# Altium schematic sheet [05] - BMS.SchDoc: BMS
size 433 x 279 mm; Author: ZAG; DrawnBy: ZAG; DocumentNumber: 5; SheetNumber: 5; SheetTotal: 8; PageSetup: Record=PageOptions|CenterHorizontal=True|CenterVertical=True|PrintScale=0.96|XCorrection=1.00|YCorrection=1.00|PrintKind=2|BorderSize=5000000|LeftOffset=0|BottomOffset=0|Orientation=2|PaperLength=4318|PaperWidth=2794|Scale=100|PaperSource=15|PrintQuality=600|MediaType=1|DitherType=10|PaperKind=11x17|PrintScaleMode=1; PCBRevision: 01; SchRevision: 01; Project: VAN BATT CTRLR V1; SchStatus: PRELIM
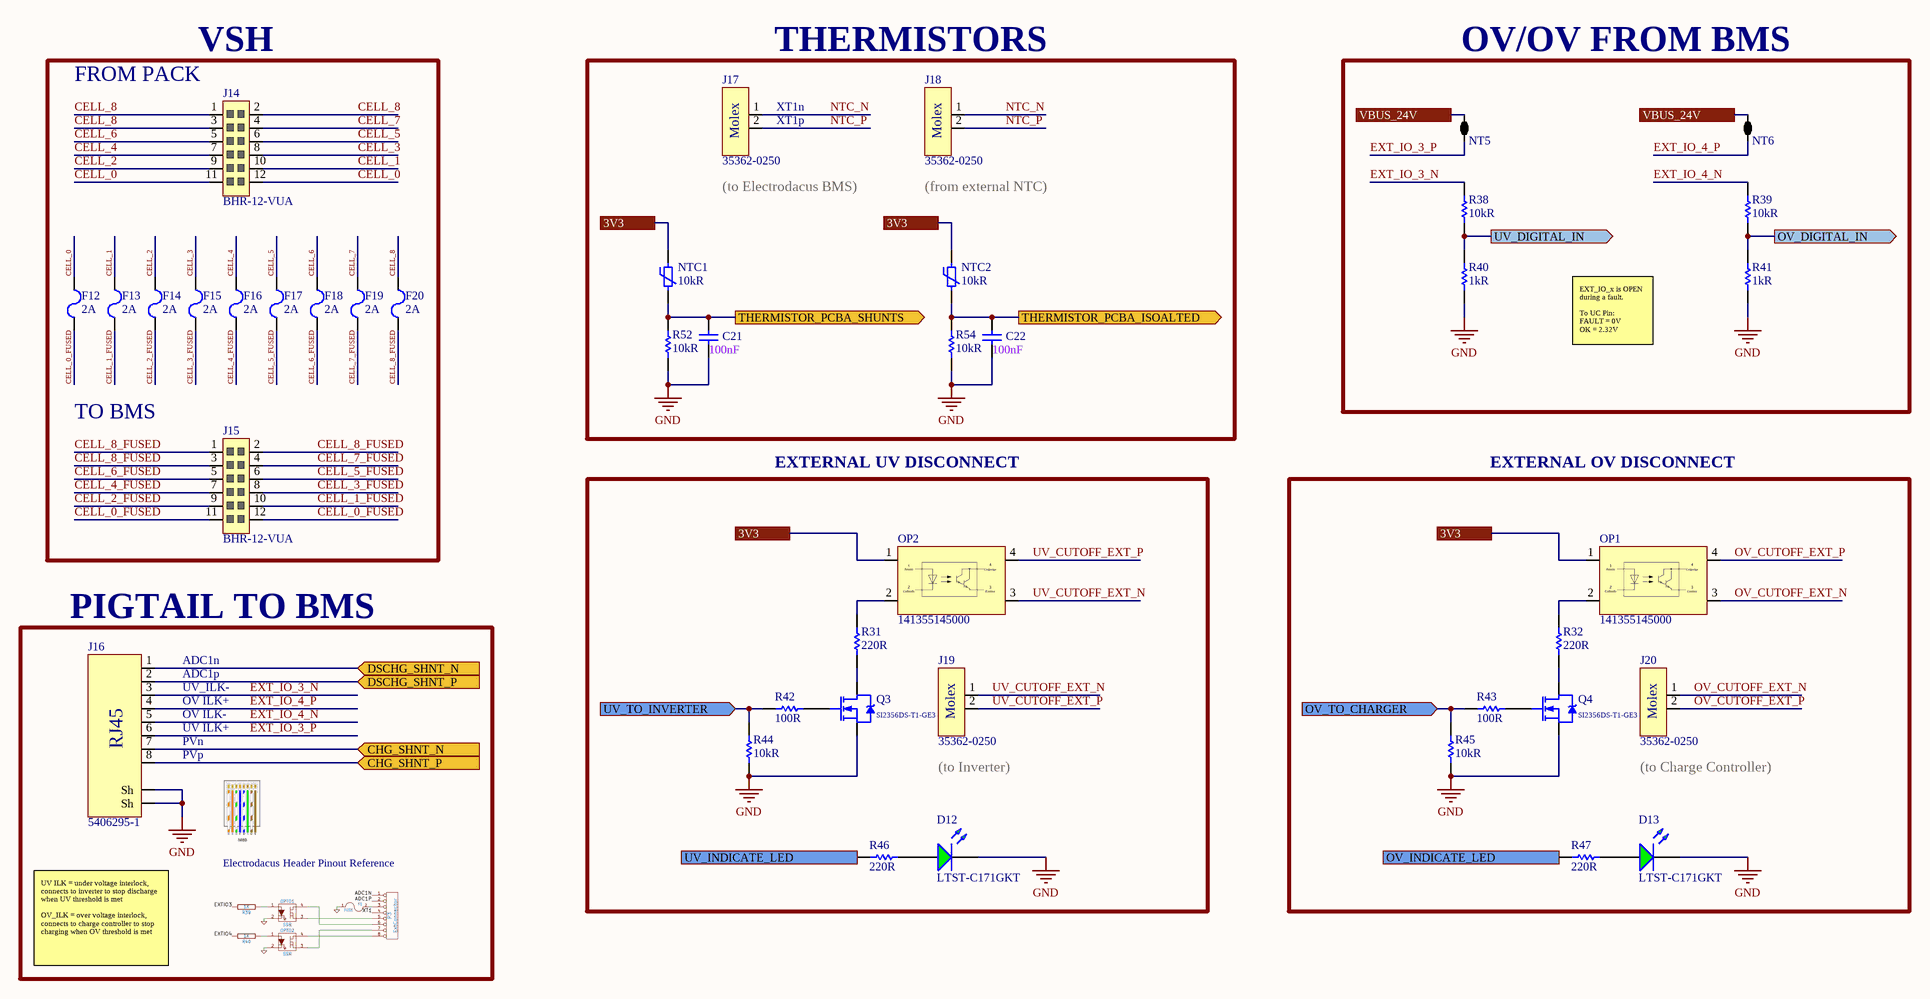
[diagram p0: [05] - BMS.SchDoc]

## Parts
C21  100nF  [INCH 0603 - METRIC 1608 - H090]
C22  100nF  [INCH 0603 - METRIC 1608 - H090]
D12  LTST-C171GKT  [LED - 0805 - GREEN]
D13  LTST-C171GKT  [LED - 0805 - GREEN]
F12  Current Rating: 2A  [FUSC0805x45]  (hidden comment: MFU0805FF02000P500)
F13  Current Rating: 2A  [FUSC0805x45]  (hidden comment: MFU0805FF02000P500)
F14  Current Rating: 2A  [FUSC0805x45]  (hidden comment: MFU0805FF02000P500)
F15  Current Rating: 2A  [FUSC0805x45]  (hidden comment: MFU0805FF02000P500)
F16  Current Rating: 2A  [FUSC0805x45]  (hidden comment: MFU0805FF02000P500)
F17  Current Rating: 2A  [FUSC0805x45]  (hidden comment: MFU0805FF02000P500)
F18  Current Rating: 2A  [FUSC0805x45]  (hidden comment: MFU0805FF02000P500)
F19  Current Rating: 2A  [FUSC0805x45]  (hidden comment: MFU0805FF02000P500)
F20  Current Rating: 2A  [FUSC0805x45]  (hidden comment: MFU0805FF02000P500)
J14  BHR-12-VUA  [SHDRV12W64P254_6X2_2284X880H880]
J15  BHR-12-VUA  [SHDRV12W64P254_6X2_2284X880H880]
J16  5406295-1  [TE_5406295-1]
J17  35362-0250  [MOLEX_35362]
J18  35362-0250  [MOLEX_35362]
J19  35362-0250  [MOLEX_35362]
J20  35362-0250  [MOLEX_35362]
NT5  2 way net tie junction  [2way_LP]  (value not drawn)  (net tie, no BOM)
NT6  2 way net tie junction  [2way_LP]  (value not drawn)  (net tie, no BOM)
NTC1  10kR  [INCH 0603 - METRIC 1608 - H055N]
NTC2  10kR  [INCH 0603 - METRIC 1608 - H055N]
OP1  141355145000  [SOT23-4P127_700X210L50X40N]
OP2  141355145000  [SOT23-4P127_700X210L50X40N]
Q3  SI2356DS-T1-GE3  [SOT23-3P95_237X112L50X42N]
Q4  SI2356DS-T1-GE3  [SOT23-3P95_237X112L50X42N]
R31  220R  [INCH 0603 - METRIC 1608 - H055]
R32  220R  [INCH 0603 - METRIC 1608 - H055]
R38  10kR  [INCH 0603 - METRIC 1508 - H050]
R39  10kR  [INCH 0603 - METRIC 1508 - H050]
R40  1kR  [INCH 0603 - METRIC 1508 - H050]
R41  1kR  [INCH 0603 - METRIC 1508 - H050]
R42  100R  [INCH 0603 - METRIC 1608 - H055]
R43  100R  [INCH 0603 - METRIC 1608 - H055]
R44  10kR  [INCH 0603 - METRIC 1508 - H050]
R45  10kR  [INCH 0603 - METRIC 1508 - H050]
R46  220R  [INCH 0603 - METRIC 1608 - H055]
R47  220R  [INCH 0603 - METRIC 1608 - H055]
R52  10kR  [INCH 0603 - METRIC 1508 - H050]
R54  10kR  [INCH 0603 - METRIC 1508 - H050]

## Blocks framed on the sheet
VSH: F12-F20 J14 J15
THERMISTORS: C21 C22 J17 J18 NTC1 NTC2 R52 R54
OV/OV FROM BMS: NT5 NT6 R38-R41
EXTERNAL UV DISCONNECT: D12 J19 OP2 Q3 R31 R42 R44 R46
EXTERNAL OV DISCONNECT: D13 J20 OP1 Q4 R32 R43 R45 R47
PIGTAIL TO BMS: J16

## Ports
3V3, CHG_SHNT_N (in), CHG_SHNT_P (in), DSCHG_SHNT_N (in), DSCHG_SHNT_P (in), OV_DIGITAL_IN (out), OV_INDICATE_LED (in), OV_TO_CHARGER (in), THERMISTOR_PCBA_ISOALTED (out), THERMISTOR_PCBA_SHUNTS (out), UV_DIGITAL_IN (out), UV_INDICATE_LED (in), UV_TO_INVERTER (in), VBUS_24V

## Nets
GND: C21.1 C22.1 D12.C D13.C J16.0(Sh) Q3.2(S) Q4.2(S) R40.1 R41.1 R44.1 R45.1 R52.1 R54.1
3V3: NTC1.2 NTC2.2 OP1.1(A) OP2.1(A) ; port 3V3
CELL_0: F12.1 J14.11 J14.12
CELL_0_FUSED: F12.2 J15.11 J15.12
CELL_1: F13.1 J14.10
CELL_1_FUSED: F13.2 J15.10
CELL_2: F14.1 J14.9
CELL_2_FUSED: F14.2 J15.9
CELL_3: F15.1 J14.8
CELL_3_FUSED: F15.2 J15.8
CELL_4: F16.1 J14.7
CELL_4_FUSED: F16.2 J15.7
CELL_5: F17.1 J14.6
CELL_5_FUSED: F17.2 J15.6
CELL_6: F18.1 J14.5
CELL_6_FUSED: F18.2 J15.5
CELL_7: F19.1 J14.4
CELL_7_FUSED: F19.2 J15.4
CELL_8: F20.1 J14.1 J14.2 J14.3
CELL_8_FUSED: F20.2 J15.1 J15.2 J15.3
CHG_SHNT_N: J16.7 ; port CHG_SHNT_N
CHG_SHNT_P: J16.8 ; port CHG_SHNT_P
DSCHG_SHNT_N: J16.1 ; port DSCHG_SHNT_N
DSCHG_SHNT_P: J16.2 ; port DSCHG_SHNT_P
EXT_IO_3_N: J16.3 R38.2
EXT_IO_3_P: J16.6 NT5.1
EXT_IO_4_N: J16.5 R39.2
EXT_IO_4_P: J16.4 NT6.1
NTC_N: J17.1 J18.1
NTC_P: J17.2 J18.2
OV_CUTOFF_EXT_N: J20.1 OP1.3(E)
OV_CUTOFF_EXT_P: J20.2 OP1.4(C)
OV_DIGITAL_IN: R39.1 R41.2 ; port OV_DIGITAL_IN
OV_INDICATE_LED: R47.1 ; port OV_INDICATE_LED
OV_TO_CHARGER: R43.1 R45.2 ; port OV_TO_CHARGER
THERMISTOR_PCBA_ISOALTED: C22.2 NTC2.1 R54.2 ; port THERMISTOR_PCBA_ISOALTED
THERMISTOR_PCBA_SHUNTS: C21.2 NTC1.1 R52.2 ; port THERMISTOR_PCBA_SHUNTS
UV_CUTOFF_EXT_N: J19.1 OP2.3(E)
UV_CUTOFF_EXT_P: J19.2 OP2.4(C)
UV_DIGITAL_IN: R38.1 R40.2 ; port UV_DIGITAL_IN
UV_INDICATE_LED: R46.1 ; port UV_INDICATE_LED
UV_TO_INVERTER: R42.1 R44.2 ; port UV_TO_INVERTER
VBUS_24V: NT5.2 NT6.2 ; port VBUS_24V
NetD12_A: D12.A R46.2
NetD13_A: D13.A R47.2
NetOP1_2: OP1.2(C) R32.2
NetOP2_2: OP2.2(C) R31.2
NetQ3_1: Q3.1(G) R42.2
NetQ3_3: Q3.3(D) R31.1
NetQ4_1: Q4.1(G) R43.2
NetQ4_3: Q4.3(D) R32.1

## Notes on the sheet
- FROM PACK
- (near J17) XT1n
- (near J17) XT1p
- (near J17) (to Electrodacus BMS)
- (from external NTC)
- EXT_IO_x is OPEN during a fault.
  To UC Pin:
  FAULT = 0V
  OK = 2.32V
- TO BMS
- (near J16) ADC1n
- (near J16) ADC1p
- (near J16) UV_ILK-
- (near J16) OV ILK-
- (near J16) UV ILK+
- (near J16) OV ILK+
- (near J16) PVn
- (near J16) PVp
- (to Inverter)
- (to Charge Controller)
- Electrodacus Header Pinout Reference
- UV ILK = under voltage interlock, connects to inverter to stop discharge when UV threshold is met
  OV_ILK = over voltage interlock, connects to charge controller to stop charging when OV threshold is met
- SHEET TITLE
- SCH REV:
- PROJECT NAME
- PCB REV:
- DATE:
- DRAWN BY
- CONTACT
- MANUFACTURER, OR SALE OF PROCESSES OR PRODUCTS WITHOUT THE EXPRESSED WRITTEN CONSENT OF
- THE INFORMATION CONTAINED HEREIN IS DEEMED TO BE CONFIDENTIAL, PROPRIETARY, AND A TRADE SECRET OF
- THIS INFORMATION MAY NOT BE USED, REPRODUCED, OR DISCLOSED AS THE DIRECT OR INDIRECT BASIS FOR THE DEVELOPMENT,
- SHEET
- www.mule-labs.com <http://www.mule-labs.com>
- OF
- SIZE: B
- DO NOT SCALE DRAWING
- (in symbol 5406295-1) RJ45

## Library data of the parts
C21 C22 = CGA3E2X7R1E104K080AA: CAP CER 0.1UF 25V X7R 0603; Manufacturer: TDK; Tolerance: 10%; Supplier 1: Digi-Key; Manufacturer Part Number: CGA3E2X7R1E104K080AA; Stock 1: 40000; Pricing 1: 1=0.1, 10=0.068, 100=0.0304, 500=0.02172, 1000=0.01706 (USD); Mount: Surface Mount; Case/Package: 0603; Weight: 7.1E-05oz; Case Code (Metric): 1608; Case Code (Imperial): 0603; Min Operating Temperature: -55°C; Max Operating Temperature: 125°C; Packaging: Tape and Reel; Capacitance: 100nF; Voltage Rating: 25V; Dielectric: X7R; Termination: SMD/SMT; Package Quantity: 1; Voltage Rating (DC): 25V; Composition: Ceramic; Length: 1.6mm; Height: 0.8mm; Depth: 0.8mm; Width: 0.031inch; Thickness: 0.035inch; Lead Free: Lead Free; REACH SVHC: No SVHC; ComponentLink1URL: https://datasheet.ciiva.com/22725/1735392-22725638.pdf; ComponentLink1Description: https://datasheet.ciiva.com/22725/1735392-22725638.pdf; ComponentLink2URL: https://datasheet.ciiva.com/24220/cga3e2x7r1e104k080aa-265934-24220022.pdf; ComponentLink2Description: https://datasheet.ciiva.com/24220/cga3e2x7r1e104k080aa-265934-24220022.pdf; ComponentLink3URL: https://datasheet.ciiva.com/22725/1735392-22725639.pdf; ComponentLink3Description: https://datasheet.ciiva.com/22725/1735392-22725639.pdf; ComponentLink4URL: https://datasheet.ciiva.com/16427/mlccspec-automotive-general-midvoltage-en-16427320.pdf; ComponentLink4Description: https://datasheet.ciiva.com/16427/mlccspec-automotive-general-midvoltage-en-16427320.pdf; ComponentLink5URL: https://datasheet.ciiva.com/23803/1735392-23803082.pdf; ComponentLink5Description: https://datasheet.ciiva.com/23803/1735392-23803082.pdf; Supplier Part Number 1: 445-5667-1-ND; Category: Capacitor
D12 D13 = LTST-C171GKT: Lite-On LTST-C171GKT, CHIPLED 0805 Series Green LED, 569 nm 2012 (0805), Rectangle Lens SMD package; Manufacturer: Vishay Lite-On; Lens Colour: Clear,Colorless; Viewing Angle: 130°; Lens Style: Clear,Diffused,Colorless,Rectangular; Luminous Intensity: 12mcd; Forward Current: 30mA; Forward Voltage: 2.1V; Power Rating: 100mW; Dominant Wavelength: 569nm; Test Current: 10mA; Lens Transparency: Clear; Number of Elements: 1; Wavelength: 585nm; Reverse Voltage: 5V; Supplier 1: Digi-Key; Manufacturer Part Number: LTST-C171GKT; Stock 1: 271428; Pricing 1: 1=0.29, 10=0.211, 25=0.1556, 100=0.1111, 250=0.07556, 500=0.06666, 1000=0.05222 (USD); Mount: Surface Mount; Case/Package: 0805; Number of Pins: 2; Color: Green; Case Code (Metric): 2012; Case Code (Imperial): 0805; Min Operating Temperature: -55°C; Max Operating Temperature: 85°C; Package Quantity: 1; Packaging: Tape and Reel; Illumination Colour: Green; Power Dissipation: 100mW; Number of LEDs: 1; Length: 2mm; Height: 0.8mm; Width: 1.25mm; Depth: 1.25mm; Radiation Hardening: No; Lead Free: Lead Free; ComponentLink1URL: https://datasheet.ciiva.com/2110/ltst-c171gkt-2110000.pdf; ComponentLink1Description: https://datasheet.ciiva.com/2110/ltst-c171gkt-2110000.pdf; ComponentLink2URL: https://datasheet.ciiva.com/2110/ltst-c171gkt-2110001.pdf; ComponentLink2Description: https://datasheet.ciiva.com/2110/ltst-c171gkt-2110001.pdf; ComponentLink3URL: https://datasheet.ciiva.com/2110/ltst-c171gkt-2110002.pdf; ComponentLink3Description: https://datasheet.ciiva.com/2110/ltst-c171gkt-2110002.pdf; ComponentLink4URL: https://datasheet.ciiva.com/16396/ltst-c171gkt-16396549.pdf; ComponentLink4Description: https://datasheet.ciiva.com/16396/ltst-c171gkt-16396549.pdf; ComponentLink5URL: https://datasheet.ciiva.com/11773/0900766b80dc0296-11773991.pdf; ComponentLink5Description: https://datasheet.ciiva.com/11773/0900766b80dc0296-11773991.pdf; ComponentLink6URL: https://datasheet.ciiva.com/12400/lite-on-ltst-c171gkt-190133-12400647.pdf; ComponentLink6Description: https://datasheet.ciiva.com/12400/lite-on-ltst-c171gkt-190133-12400647.pdf; Supplier Part Number 1: 160-1423-1-ND; Category: LED
F12-F20 = MFU0805FF02000P500: FUSE 2A 32V SMT 0805 THIN; Manufacturer 1: Vishay Beyschlag; Approvals: UL; Description 1: Fuse; 24 Milliohms to 660 Milliohms (Cold) @ 0.1; 32 V; 0805; 15 ° C; 35; Category 1: Fuses; Body Material: Ceramic; Fuse Type: Board Mount (Cartridge Style Excluded); DC Cold Resistance: 67mR; Manufacturer Part Number: MFU0805FF02000P500; Supplier 1: Digi-Key; Supplier Part Number 1: 749-1743-1-ND; Case/Package: 0805; Case Code (Imperial): 0805; Category: Fuse; Manufacturer Part Number 1: MFU0805FF02000P500; RoHS 1: Yes; Stock 1: 5535; Pricing 1: 1=0.48000, 5=0.46800, 10=0.45300, 50=0.38100, 100=0.31630, 250=0.28756, 500=0.24440, 1000=0.21566 (USD); Mount: Surface Mount,PCB; Number of Pins: 2; Min Operating Temperature: -55°C; Max Operating Temperature: 125°C; Termination: SMD/SMT; Package Quantity: 5000; Voltage Rating (DC): 32V; Packaging: Tape and Reel; Resistance: 67mR; Length: 0.079inch; Height: 0.018inch; Width: 0.049inch; Lead Free: Lead Free; ComponentLink4URL: https://datasheet.ciiva.com/18427/70121790-18427623.pdf?src-supplier=Allied+Electronics; ComponentLink4Description: https://datasheet.ciiva.com/18427/70121790-18427623.pdf?src-supplier=Allied+Electronics; ComponentLink5URL: https://datasheet.ciiva.com/11337/mfuserie-11337802.pdf?src-supplier=Avnet; ComponentLink5Description: https://datasheet.ciiva.com/11337/mfuserie-11337802.pdf?src-supplier=Avnet; ComponentLink6URL: https://datasheet.ciiva.com/4485/mfuserie-239895-4485662.pdf?src-supplier=Mouser; ComponentLink6Description: https://datasheet.ciiva.com/4485/mfuserie-239895-4485662.pdf?src-supplier=Mouser; RoHS: Yes
J14 J15 = BHR-12-VUA: CONN HEADER VERT 12POS 2.54MM; Manufacturer: Adam Tech; Number of Positions: 12; Gender: Male; Connector Type: Male Pin; Pitch: 0.1inch; Supplier 1: Digi-Key; Manufacturer Part Number: BHR-12-VUA; RoHS: Yes; Mount: Through Hole; Contact Plating: Gold; Contact Material: Copper; Color: Black; Number of Rows: 2; Packaging: Bulk; Termination: Solder; Number of Contacts: 12; Row Spacing: 0.1inch; REACH SVHC: Unknown; Supplier Part Number 1: 2057-BHR-12-VUA-ND
J16 = 5406295-1: Conn RJ-45 F 8 POS RA Thru-Hole; Manufacturer: TE Connectivity; Shielding: Shielded; Number of Ports: 1; Direction: Down; Number of Contacts: 8; Max Voltage Rating (AC): 150V; Connector Type: Jack; Keyed: No; Element Configuration: Single; PCB Mounting Orientation: Right Angle; Pitch: 2.54mm; Tail Length: 3.56mm; PCB Thickness: 1.57mm; Supplier 1: Digi-Key; Manufacturer Part Number: 5406295-1; RoHS: Yes; Category: Modular / Ethernet Connectors; Stock 1: 1850; Pricing 1: 1=3.11000, 10=2.98100, 25=2.73280, 50=2.60840, 100=2.48420, 250=2.17372, 500=2.11160, 1000=1.80107, 2500=1.67686 (USD); Contact Plating: Gold; Contact Material: Bronze; Housing Color: Black; Housing Material: Nylon; Min Operating Temperature: -40°C; Max Operating Temperature: 85°C; Termination: Solder; Orientation: Right Angle; Packaging: Tray; Package Quantity: 80; Number of Rows: 1; Number of Positions Loaded: 8; Number of Positions: 8; Length: 17.78mm; Depth: 21.34mm; Radiation Hardening: No; Flammability Rating: UL94 V-0; ELV: Compliant; RoHS Compliant: Yes; ComponentLink1URL: https://datasheet.ciiva.com/18490/eng-cd-5406295-b1-18490859.pdf?src-supplier=Digi-Key; ComponentLink1Description: https://datasheet.ciiva.com/18490/eng-cd-5406295-b1-18490859.pdf?src-supplier=Digi-Key; Supplier Part Number 1: A115395-ND
J17-J20 = 35362-0250: Conn Shrouded Header HDR 2 POS 2mm Solder ST Thru-Hole Bag; Manufacturer: Molex; Current Rating: 2A; Number of Positions: 2; Gender: Male; Contact Resistance: 20mR; Voltage Rating: 125V; Max Voltage Rating (AC): 600V; Max Voltage Rating (DC): 125.125kV; Insulation Resistance: 1GR; Glow Wire Compliant: Non-compliant; Supplier 1: Digi-Key; Manufacturer Part Number: 35362-0250; Stock 1: 15060; Pricing 1: 1=0.27000, 10=0.25400, 100=0.17630, 500=0.14916, 1000=0.12204, 5000=0.10848, 10000=0.09831 (USD); RoHS: Yes; Mount: Through Hole,Cable; Color: Natural; Housing Color: Natural; Housing Material: Nylon; Contact Material: Brass; Contact Plating: Tin,Gold; Min Operating Temperature: -40°C; Max Operating Temperature: 105°C; Packaging: Bulk; Termination: Solder; Number of Rows: 1; Package Quantity: 1000; Orientation: Vertical; Number of Contacts: 2; Voltage Rating (AC): 125V; Voltage Rating (DC): 125V; Max Current Rating: 2A; Number of Circuits: 2; Length: 16.8mm; Height: 2.3mm; Pitch: 2mm; Width: 8.3mm; Depth: 2.3mm; Lead Pitch: 2mm; Radiation Hardening: No; REACH SVHC: Unknown; Halogen Free: Low Halogen; Lead Free: Lead Free; Flammability Rating: UL94 V-0; ComponentLink1URL: https://datasheet.ciiva.com/7436/1710398-7436100.pdf?src-supplier=Newark; ComponentLink1Description: https://datasheet.ciiva.com/7436/1710398-7436100.pdf?src-supplier=Newark; ComponentLink2URL: https://datasheet.ciiva.com/16658/0353620250-pcb-headers-16658021.pdf?src-supplier=Avnet+Europe; ComponentLink2Description: https://datasheet.ciiva.com/16658/0353620250-pcb-headers-16658021.pdf?src-supplier=Avnet+Europe; ComponentLink3URL: https://datasheet.ciiva.com/5155/0353620250-pcb-headers-163392-5155548.pdf?src-supplier=Mouser; ComponentLink3Description: https://datasheet.ciiva.com/5155/0353620250-pcb-headers-163392-5155548.pdf?src-supplier=Mouser; ComponentLink4URL: https://datasheet.ciiva.com/19461/1299024-19461900.pdf?src-supplier=Jameco; ComponentLink4Description: https://datasheet.ciiva.com/19461/1299024-19461900.pdf?src-supplier=Jameco; ComponentLink5URL: https://datasheet.ciiva.com/30136/325870353620250-pcb-headers-30136716.pdf?src-supplier=Onlinecomponents.com; ComponentLink5Description: https://datasheet.ciiva.com/30136/325870353620250-pcb-headers-30136716.pdf?src-supplier=Onlinecomponents.com; ComponentLink6URL: https://datasheet.ciiva.com/7920/1905931-7920887.pdf?src-supplier=Element14; ComponentLink6Description: https://datasheet.ciiva.com/7920/1905931-7920887.pdf?src-supplier=Element14; Supplier Part Number 1: WM18920-ND
NT5 NT6 = 2way: ComponentLink1URL: http://www.edatools.cz/addons; ComponentLink1Description: Source; FootprintNote: LP=12mil, MP=40mil, HP=120mil
NTC1 NTC2 = NCP18XV103E03RB: Thermistor NTC 10K Ohm 3% 2-Pin 0603 Surface Mount Solder Pad 3934K T/R; Manufacturer: Murata; Max Power Dissipation: 100mW; Supplier 1: Digi-Key; Manufacturer Part Number: NCP18XV103E03RB; RoHS: Yes; Category: Thermistors; Stock 1: 39439; Pricing 1: 1=0.25000, 5=0.22800, 10=0.20300, 25=0.18160, 50=0.15960, 100=0.13610, 500=0.11258, 1000=0.09425 (USD); Mount: Surface Mount; Case/Package: 0603; Number of Pins: 2; Case Code (Metric): 1608; Case Code (Imperial): 0603; Min Operating Temperature: -40°C; Max Operating Temperature: 125°C; Package Quantity: 1; Packaging: Tape and Reel; Tolerance: 3%; Resistance: 10kR; Termination: SMD/SMT; Power Rating: 100mW; Length: 1.6mm; Width: 0.8mm; Height: 0.8mm; Depth: 0.8mm; Radiation Hardening: No; RoHS Compliant: Yes; ComponentLink1URL: http://www.mouser.com/ds/2/281/r44e-3685.pdf?src-supplier=Mouser; ComponentLink1Description: http://www.mouser.com/ds/2/281/r44e-3685.pdf?src-supplier=Mouser; ComponentLink2URL: http://www.murata.com/~/media/webrenewal/support/library/catalog/products/thermistor/ntc/r44e.ashx?src-supplier=Avnet; ComponentLink2Description: http://www.murata.com/~/media/webrenewal/support/library/catalog/products/thermistor/ntc/r44e.ashx?src-supplier=Avnet; ComponentLink3URL: http://www.murata.com/~/media/webrenewal/support/library/catalog/products/thermistor/ntc/r44e.ashx?src-supplier=Digi-Key; ComponentLink3Description: http://www.murata.com/~/media/webrenewal/support/library/catalog/products/thermistor/ntc/r44e.ashx?src-supplier=Digi-Key; ComponentLink4URL: http://www.murata.com/products/catalog/pdf/r44e.pdf?src-supplier=Digi-Key; ComponentLink4Description: http://www.murata.com/products/catalog/pdf/r44e.pdf?src-supplier=Digi-Key; Supplier Part Number 1: 490-12102-1-ND
OP1 OP2 = 141355145000: Optocoupler, Transistor, 3.75Kv, Sop Rohs Compliant: Yes; Manufacturer: Wurth Electronics; Supplier 1: Digi-Key; Manufacturer Part Number: 141355145000; RoHS: No; Stock 1: 2951; Pricing 1: 1=0.71000, 100=0.61200, 250=0.55500, 500=0.49800, 1000=0.41200 (USD); Supplier Part Number 1: 732-141355145000CT-ND
Q3 Q4 = SI2356DS-T1-GE3: Si2356DS Series 40 V 3.2 A 51 mOhm Surface Mount N-Channel Mosfet - SOT-23-3; Manufacturer: Vishay Siliconix; Rds On Max: 51mR; Input Capacitance: 370pF; Rise Time: 52ns; Drain to Source Voltage (Vdss): 40V; Continuous Drain Current (ID): 4.3A; Max Power Dissipation: 1.7W; Gate to Source Voltage (Vgs): 12V; Drain to Source Resistance: 56mR; Fall Time: 53ns; Turn-Off Delay Time: 18ns; Threshold Voltage: 1.5V; Element Configuration: Single; Number of Channels: 1; Turn-On Delay Time: 10ns; Supplier 1: Digi-Key; Manufacturer Part Number: SI2356DS-T1-GE3; RoHS: Yes; Category: MOSFETs; Stock 1: 50; Pricing 1: 1=0.42000, 10=0.34200, 100=0.23300, 500=0.17476, 1000=0.13108 (USD); Mount: Surface Mount; Case/Package: TO-236-3; Number of Pins: 3; Weight: 0.050717oz; Min Operating Temperature: -55°C; Max Operating Temperature: 150°C; Packaging: Tape and Reel; Package Quantity: 3000; Drain to Source Breakdown Voltage: 40V; REACH SVHC: No SVHC; Lead Free: Lead Free; RoHS Compliant: Yes; ComponentLink1URL: https://datasheet.ciiva.com/29755/si2356ds-29755664.pdf?src-supplier=Digi-Key; ComponentLink1Description: https://datasheet.ciiva.com/29755/si2356ds-29755664.pdf?src-supplier=Digi-Key; ComponentLink2URL: https://datasheet.ciiva.com/24111/si2356ds-268760-24111179.pdf?src-supplier=Mouser; ComponentLink2Description: https://datasheet.ciiva.com/24111/si2356ds-268760-24111179.pdf?src-supplier=Mouser; ComponentLink3URL: https://datasheet.ciiva.com/29755/si2356ds-29755653.pdf?src-supplier=Digi-Key; ComponentLink3Description: https://datasheet.ciiva.com/29755/si2356ds-29755653.pdf?src-supplier=Digi-Key; ComponentLink4URL: https://datasheet.ciiva.com/29755/si2356ds-29755658.pdf?src-supplier=Digi-Key; ComponentLink4Description: https://datasheet.ciiva.com/29755/si2356ds-29755658.pdf?src-supplier=Digi-Key; Supplier Part Number 1: SI2356DS-T1-GE3CT-ND
R31 R32 R46 R47 = RC0603FR-07220RL: RES SMD 220 OHM 1% 1/10W 0603; Manufacturer: Yageo; Temperature Coefficient: 100ppm/°C; Voltage Rating (DC): 50V; Power Rating: 100mW; Supplier 1: Digi-Key; Manufacturer Part Number: RC0603FR-07220RL; Stock 1: 8341820; Case/Package: 0603; Number of Pins: 2; Case Code (Imperial): 0603; Case Code (Metric): 1608; Min Operating Temperature: -55°C; Max Operating Temperature: 155°C; Resistance: 220R; Tolerance: 1%; Packaging: Tape and Reel; Composition: Thick Film; Voltage Rating: 50V; Package Quantity: 1; Termination: SMD/SMT; Number of Terminations: 2; Military Standard: Not; Max Power Dissipation: 100mW; Features: Moisture Resistant; Length: 1.6mm; Height: 0.022inch; Width: 0.031inch; Depth: 0.8mm; REACH SVHC: No SVHC; Lead Free: Lead Free; ComponentLink1URL: http://www.yageo.com/documents/recent/PYu-RC_Group_51_RoHS_L_9.pdf; ComponentLink1Description: http://www.yageo.com/documents/recent/PYu-RC_Group_51_RoHS_L_9.pdf; ComponentLink2URL: http://documents.rs-components.com/techlib://itc_doclist_GB.htm?stockno=5050303; ComponentLink2Description: http://documents.rs-components.com/techlib://itc_doclist_GB.htm?stockno=5050303; ComponentLink3URL: http://www.farnell.com/datasheets/1738695.pdf; ComponentLink3Description: http://www.farnell.com/datasheets/1738695.pdf; Supplier Part Number 1: 311-220HRCT-ND
R38 R39 R44 R45 R52 R54 = RR0816P-103-D: RES SMD 10K OHM 0.5% 1/16W 0603; Manufacturer: Susumu; Power Rating: 63mW; Voltage Rating: 75V; Temperature Coefficient: 25ppm/°C; Supplier 1: Digi-Key; Manufacturer Part Number: RR0816P-103-D; Stock 1: 1106095; Pricing 1: 1=0.11, 10=0.098, 100=0.0376, 1000=0.01654, 2500=0.01428 (USD); Case/Package: 0603; Number of Pins: 2; Weight: 7.1E-05oz; Case Code (Imperial): 0603; Case Code (Metric): 1608; Min Operating Temperature: -55°C; Max Operating Temperature: 125°C; Packaging: Tape and Reel; Resistance: 10kR; Tolerance: 0.5%; Package Quantity: 1; Termination: SMD/SMT; Composition: Thin Film; Number of Terminations: 2; Max Power Dissipation: 63mW; Voltage Rating (DC): 75V; Length: 1.6mm; Height: 0.4mm; Width: 0.8mm; Depth: 0.8mm; REACH SVHC: Unknown; Lead Free: Lead Free; ComponentLink1URL: https://datasheet.ciiva.com/11820/0900766b80808d64-11820656.pdf; ComponentLink1Description: https://datasheet.ciiva.com/11820/0900766b80808d64-11820656.pdf; ComponentLink2URL: https://datasheet.ciiva.com/2487/rr-data-sheet-2487034.pdf; ComponentLink2Description: https://datasheet.ciiva.com/2487/rr-data-sheet-2487034.pdf; ComponentLink3URL: https://datasheet.ciiva.com/2487/rr-data-sheet-2487035.pdf; ComponentLink3Description: https://datasheet.ciiva.com/2487/rr-data-sheet-2487035.pdf; ComponentLink4URL: https://datasheet.ciiva.com/2487/rr-data-sheet-2487036.pdf; ComponentLink4Description: https://datasheet.ciiva.com/2487/rr-data-sheet-2487036.pdf; Supplier Part Number 1: RR08P10.0KDCT-ND; Category: Resistor
R40 R41 = CRCW06031K00FKEA: RES SMD 1K OHM 1% 1/10W 0603; Manufacturer: Vishay Dale; Temperature Coefficient: 100ppm/°C; Power Rating: 100mW; Voltage Rating: 75V; Supplier 1: Digi-Key; Manufacturer Part Number: CRCW06031K00FKEA; RoHS: Yes; Category: Chip SMD Resistors; Stock 1: 445458; Pricing 1: 1=0.10000, 10=0.03400, 100=0.01390, 1000=0.00624, 2500=0.00542 (USD); Mount: Surface Mount; Case/Package: 0603; Number of Pins: 2; Contact Plating: Tin; Weight: 7.1E-05oz; Case Code (Metric): 1608; Case Code (Imperial): 0603; Size Code: 0603; Min Operating Temperature: -55°C; Max Operating Temperature: 155°C; Resistor Type: Thick Film; Resistance: 1kR; Tolerance: 1%; Termination: SMD/SMT; Packaging: Tape and Reel; Package Quantity: 10; Number of Terminations: 2; Max Power Dissipation: 100mW; Voltage Rating (DC): 75V; Features: Automotive AEC-Q200; Series: CRCW; Technology: THICK FILM; Construction: Rectangular; Resistance Tolerance: 1%; Length: 1.55mm; Width: 0.033inch; Height: 0.45mm; Depth: 0.85mm; Radiation Hardening: No; Lead Free: Lead Free; RoHS Compliant: Yes; REACH SVHC: Unknown; Military Standard: Not; ComponentLink1URL: https://datasheet.ciiva.com/11808/0900766b80d98afc-11808625.pdf?src-supplier=RSComponents; ComponentLink1Description: https://datasheet.ciiva.com/11808/0900766b80d98afc-11808625.pdf?src-supplier=RSComponents; ComponentLink2URL: https://datasheet.ciiva.com/8336/dcrcwe3-8336822.pdf?src-supplier=Avnet; ComponentLink2Description: https://datasheet.ciiva.com/8336/dcrcwe3-8336822.pdf?src-supplier=Avnet; ComponentLink3URL: https://datasheet.ciiva.com/16515/dcrcwe3-16515078.pdf?src-supplier=Avnet+Asia; ComponentLink3Description: https://datasheet.ciiva.com/16515/dcrcwe3-16515078.pdf?src-supplier=Avnet+Asia; ComponentLink4URL: https://datasheet.ciiva.com/3257/dcrcwe3-3257132.pdf?src-supplier=Avnet; ComponentLink4Description: https://datasheet.ciiva.com/3257/dcrcwe3-3257132.pdf?src-supplier=Avnet; ComponentLink5URL: https://datasheet.ciiva.com/2465/dcrcwe3-2465534.pdf?src-supplier=Digi-Key; ComponentLink5Description: https://datasheet.ciiva.com/2465/dcrcwe3-2465534.pdf?src-supplier=Digi-Key; ComponentLink6URL: https://datasheet.ciiva.com/16893/dcrcwe3-16893742.pdf?src-supplier=Avnet+Europe; ComponentLink6Description: https://datasheet.ciiva.com/16893/dcrcwe3-16893742.pdf?src-supplier=Avnet+Europe; ComponentLink7URL: https://datasheet.ciiva.com/2465/dcrcwe3-2465535.pdf?src-supplier=Digi-Key; ComponentLink7Description: https://datasheet.ciiva.com/2465/dcrcwe3-2465535.pdf?src-supplier=Digi-Key; ComponentLink8URL: https://datasheet.ciiva.com/2465/dcrcwe3-2465536.pdf?src-supplier=Digi-Key; ComponentLink8Description: https://datasheet.ciiva.com/2465/dcrcwe3-2465536.pdf?src-supplier=Digi-Key; ComponentLink9URL: https://datasheet.ciiva.com/26316/fld-crcw-e3-data-en-26316551.pdf?src-supplier=Distrelec; ComponentLink9Description: https://datasheet.ciiva.com/26316/fld-crcw-e3-data-en-26316551.pdf?src-supplier=Distrelec; ComponentLink10URL: https://datasheet.ciiva.com/46441/1720486-46441623.pdf?src-supplier=Element14; ComponentLink10Description: https://datasheet.ciiva.com/46441/1720486-46441623.pdf?src-supplier=Element14; ComponentLink11URL: https://datasheet.ciiva.com/46441/1720486-46441622.pdf?src-supplier=Element14; ComponentLink11Description: https://datasheet.ciiva.com/46441/1720486-46441622.pdf?src-supplier=Element14; ComponentLink12URL: https://datasheet.ciiva.com/46385/1697337-46385497.pdf?src-supplier=Element14; ComponentLink12Description: https://datasheet.ciiva.com/46385/1697337-46385497.pdf?src-supplier=Element14; ComponentLink13URL: https://datasheet.ciiva.com/16199/dcrcwe3-16199053.pdf?src-supplier=Future+Electronics; ComponentLink13Description: https://datasheet.ciiva.com/16199/dcrcwe3-16199053.pdf?src-supplier=Future+Electronics; Supplier Part Number 1: 541-1.00KHCT-ND
R42 R43 = CPF0603B100RE1: RES SMD 100 OHM 0.1% 1/16W 0603; Manufacturer: TE Connectivity Neohm; Temperature Coefficient: 25ppm/°C; Power Rating: 63mW; Voltage Rating: 50V; Number of Resistors: 1; Supplier 1: Digi-Key; Manufacturer Part Number: CPF0603B100RE1; RoHS: Yes; Category: Chip SMD Resistors; Stock: 7060; Pricing: 1=0.65000, 10=0.46300, 100=0.24080 (USD); Mount: Surface Mount; Case/Package: 0603; Number of Pins: 2; Weight: 7.1E-05oz; Case Code (Imperial): 0603; Case Code (Metric): 1608; Min Operating Temperature: -55°C; Max Operating Temperature: 155°C; Resistance: 100R; Tolerance: 0.1%; Packaging: Tape and Reel; Package Quantity: 1000; Composition: Thin Film; Number of Terminations: 2; Termination: Solder; Voltage Rating (DC): 50V; Length: 1.55mm; Height: 0.45mm; Width: 0.8mm; REACH SVHC: No SVHC; ELV: Compliant; ComponentLink1URL: https://datasheet.ciiva.com/6767/1652074-6767153.pdf?src-supplier=Newark; ComponentLink1Description: https://datasheet.ciiva.com/6767/1652074-6767153.pdf?src-supplier=Newark; ComponentLink2URL: https://datasheet.ciiva.com/6116/eng-ds-1773200-j-6116235.pdf?src-supplier=Farnell; ComponentLink2Description: https://datasheet.ciiva.com/6116/eng-ds-1773200-j-6116235.pdf?src-supplier=Farnell; ComponentLink3URL: https://datasheet.ciiva.com/12834/eng-ds-1773200-i-12834812.pdf?src-supplier=Mouser; ComponentLink3Description: https://datasheet.ciiva.com/12834/eng-ds-1773200-i-12834812.pdf?src-supplier=Mouser; Supplier Part Number 1: A102330CT-ND